# EAGLE design cdf-teensy-interrupter-v3 (EAGLE 9.6.2)
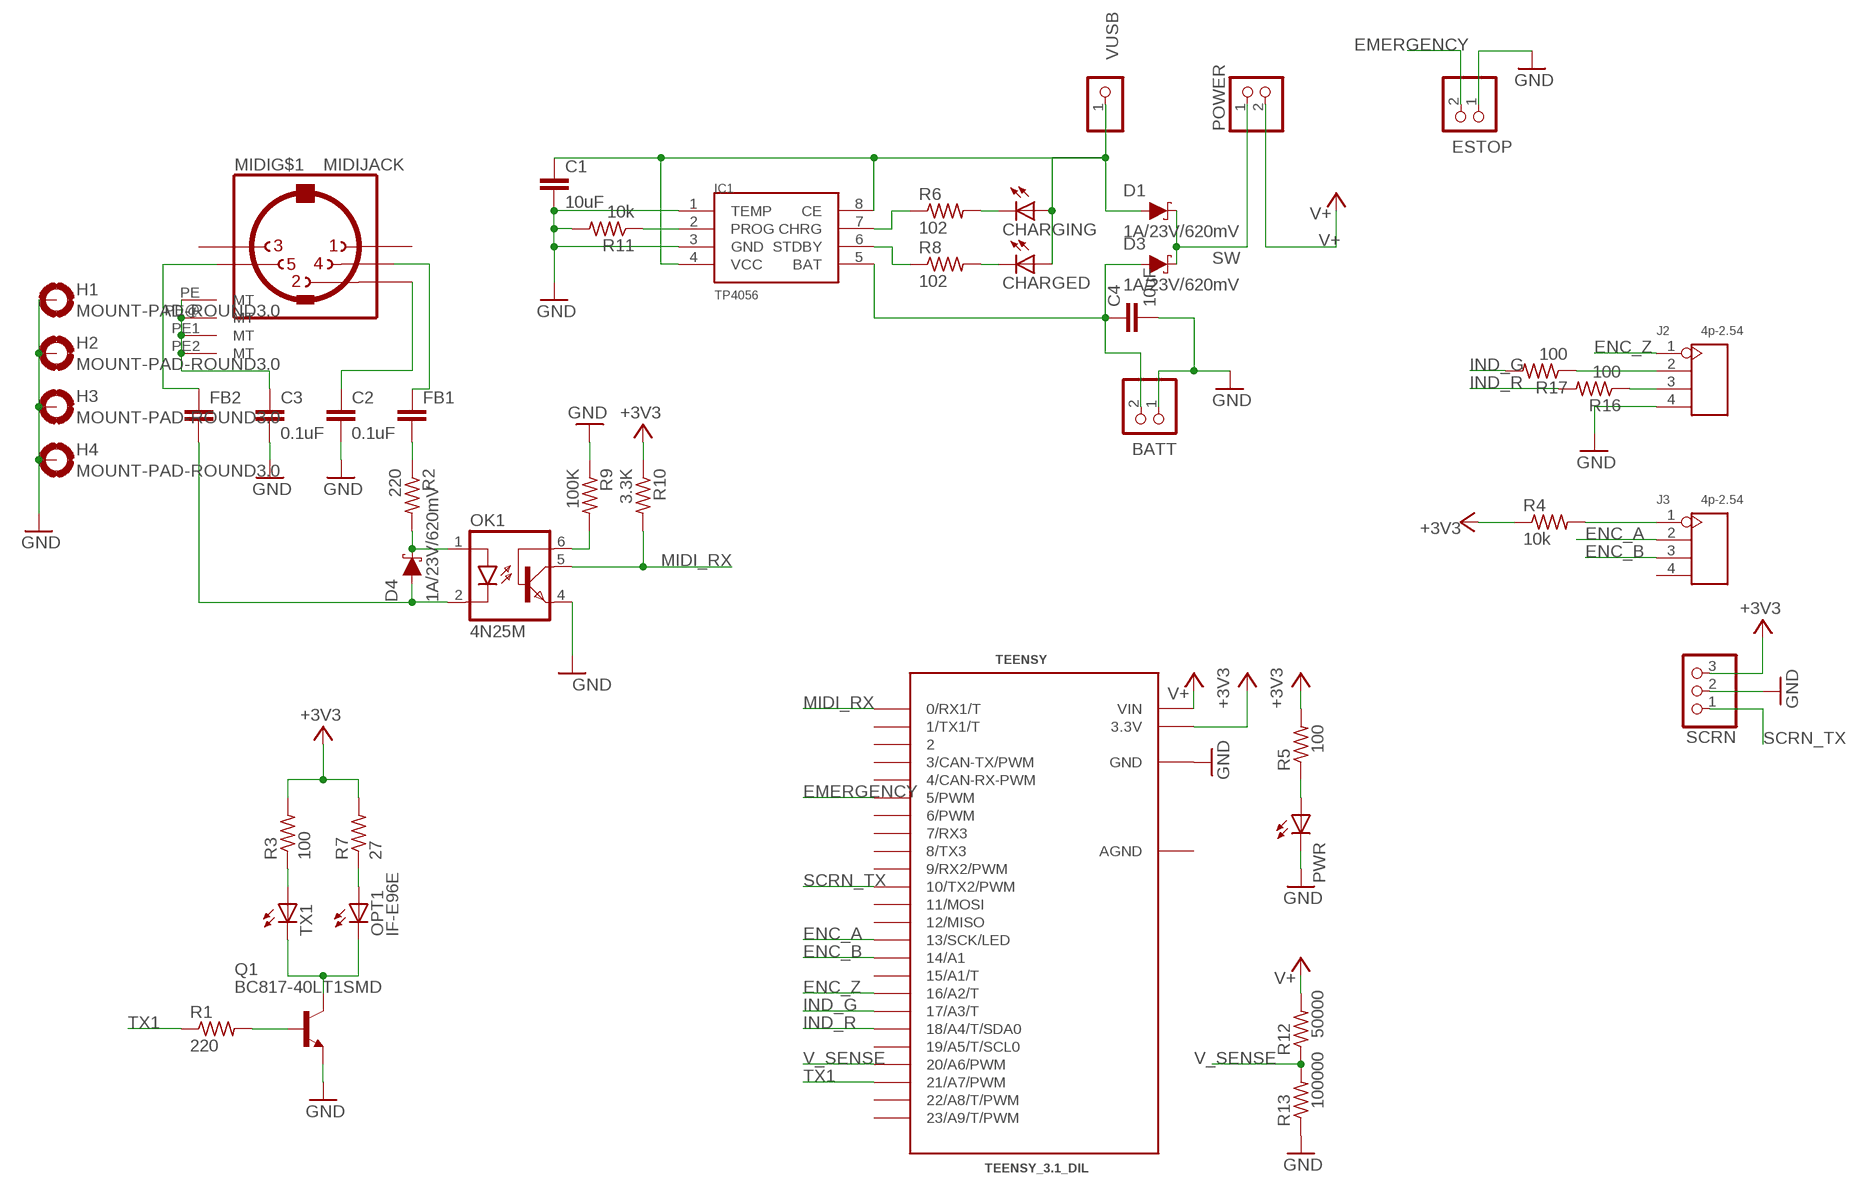
[diagram p0: schematic, sheet 1]

## Parts
BATT  PINHD-1X2  [1X02]
C1  10uF  C-EUC0805  [C0805]
C2  0.1uF  C-EUC0805  [C0805]
C3  0.1uF  C-EUC0805  [C0805]
C4  10uF  C-EUC0805  [C0805]
CHARGED  LEDCHIP-LED0805  [CHIP-LED0805]
CHARGING  LEDCHIP-LED0805  [CHIP-LED0805]
D1  1A/23V/620mV  DIODE-SCHOTTKY-BAT20J  [SOD-323]
D3  1A/23V/620mV  DIODE-SCHOTTKY-BAT20J  [SOD-323]
D4  1A/23V/620mV  DIODE-SCHOTTKY-BAT20J  [SOD-323]
ESTOP  PINHD-1X2  [1X02]
FB1  C-EUC0805  [C0805]
FB2  C-EUC0805  [C0805]
H1  MOUNT-PAD-ROUND3.0  [3,0-PAD]
H2  MOUNT-PAD-ROUND3.0  [3,0-PAD]
H3  MOUNT-PAD-ROUND3.0  [3,0-PAD]
H4  MOUNT-PAD-ROUND3.0  [3,0-PAD]
IC1  TP4056  [SOP-8]
J2  4p-2.54  DIP-BLACK-MALE-HEADER-VERT(4P-2.54)  [H4-2.54]
J3  4p-2.54  DIP-BLACK-MALE-HEADER-VERT(4P-2.54)  [H4-2.54]
MIDI  MIDIJACK  [CP-2350]
OK1  4N25M  [DIL06]
OPT1  IF-E96E  [IF-E96E]
POWER  PINHD-1X2  [1X02]
PWR  LEDCHIP-LED0805  [CHIP-LED0805]
Q1  BC817-40LT1SMD  [SOT23-BEC]
R1  220  R-US_R0805  [R0805]
R2  220  R-US_R0805  [R0805]
R3  100  R-US_R0805  [R0805]
R4  10k  R-US_R0805  [R0805]
R5  100  R-US_R0805  [R0805]
R6  102  R-US_R0805  [R0805]
R7  27  R-US_R0805  [R0805]
R8  102  R-US_R0805  [R0805]
R9  100K  R-US_R0805  [R0805]
R10  3.3K  R-US_R0805  [R0805]
R11  10k  R-US_R0805  [R0805]
R12  50000  R-US_R0805  [R0805]
R13  100000  R-US_R0805  [R0805]
R16  100  R-US_R0805  [R0805]
R17  100  R-US_R0805  [R0805]
SCRN  PINHD-1X3  [1X03]
TEENSY  TEENSY_3.1_DIL  [TEENSY3-DIL]
TX1  LEDCHIP-LED0805  [CHIP-LED0805]
VUSB  PINHD-1X1  [1X01]

## Nets
+3V3: R3.2 R4.1 R5.2 R7.2 R10.1 SCRN.3 TEENSY.3.3V
B+: BATT.2 C4.1 D3.A IC1.5(BAT)
EMERGENCY: ESTOP.2 TEENSY.5(5/PWM)
ENC_A: J3.2 TEENSY.13(13/SCK/LED)
ENC_B: J3.3 TEENSY.14/A0(14/A1)
ENC_Z: J2.1 TEENSY.16/A2(16/A2/T)
GND: BATT.1 C1.2 C2.2 C3.2 C4.2 ESTOP.1 H1.B3,0(MOUNT) H2.B3,0(MOUNT) H3.B3,0(MOUNT) H4.B3,0(MOUNT) IC1.1(TEMP) IC1.3(GND) J2.4 OK1.4(EMI) PWR.C Q1.E R9.1 R11.2 R13.1 SCRN.2 TEENSY.GND
IND_G: R17.2 TEENSY.17/A3(17/A3/T)
IND_R: R16.2 TEENSY.18/A4(18/A4/T/SDA0)
MIDI_RX: OK1.5(COL) R10.2 TEENSY.0(0/RX1/T)
N$1: FB1.1 MIDI.4
N$2: D4.C OK1.1(A) R2.2
N$3: D4.A FB2.2 OK1.2(C)
N$4: OK1.6(BAS) R9.2
N$5: J3.1 R4.2
N$6: J2.2 R17.1
N$7: Q1.B R1.2
N$8: OPT1.P$2_ANODE+(A) R7.1
N$9: PWR.A R5.1
N$10: R3.1 TX1.A
N$11: OPT1.P$1_CATHODE-(C) Q1.C TX1.C
N$12: FB1.2 R2.1
N$13: C2.1 MIDI.2
N$14: C3.1 MIDI.PE1(MT) MIDI.PE2(MT) MIDI.PE(MT) MIDI.PE@(MT)
N$15: FB2.1 MIDI.5
N$16: IC1.7(CHRG) R6.1
N$17: IC1.6(STDBY) R8.1
N$18: CHARGED.C R8.2
N$19: CHARGING.C R6.2
N$20: J2.3 R16.1
N$21: IC1.2(PROG) R11.1
SCRN_TX: SCRN.1 TEENSY.10(10/TX2/PWM)
SW: D1.C D3.C POWER.1
TX1: R1.1 TEENSY.21/A7(21/A7/PWM)
V+: POWER.2 R12.2 TEENSY.VIN
V_SENSE: R12.1 R13.2 TEENSY.20/A6(20/A6/PWM)
V_USB: C1.1 CHARGED.A CHARGING.A D1.A IC1.4(VCC) IC1.8(CE) VUSB.1
Unconnected: J3.4 MIDI.1 MIDI.3 TEENSY.1(1/TX1/T) TEENSY.2 TEENSY.3(3/CAN-TX/PWM) TEENSY.4(4/CAN-RX-PWM) TEENSY.6(6/PWM) TEENSY.7(7/RX3) TEENSY.8(8/TX3) TEENSY.9(9/RX2/PWM) TEENSY.11(11/MOSI) TEENSY.12(12/MISO) TEENSY.15/A1(15/A1/T) TEENSY.19/A5(19/A5/T/SCL0) TEENSY.22/A8(22/A8/T/PWM) TEENSY.23/A9(23/A9/T/PWM)

## Power pins joined to a net without a drawn wire
AGND: TEENSY.AGND

## Library data of the parts
BATT ESTOP POWER = pinhead:PINHD-1X2: PIN HEADER
C1-C4 FB1 FB2 = rcl:C-EU: CAPACITOR, European symbol; SPICEPREFIX: C
CHARGED CHARGING PWR TX1 = adafruit:LED: LED OSRAM: - CHIPLED LG R971, LG N971, LY N971, LG Q971, LY Q971, LO R971, LY R971 LH N974, LH R974 LS Q976, LO Q976, LY Q976 LO Q996 - Hyper CHIPLED LW Q18S LB Q993, LB Q99A, LB R99A - SideLED LS A670, LO A670, LY A670, LG A670, LP A670 LB A673, LV A673, LT A673, LW A673 LH A674 LY A675 LS A676, LA A676, LO A676, LY A676, LW A676 LS A679, LY A679, LG A679 - Hyper Micro SIDELED® LS Y876, LA Y876, LO Y876, LY Y876 LT Y87S - SmartLED LW L88C, LW L88S LB L89C, LB L89S, LG L890 LS L89K, LO L89K, LY L89K LS L896, LA L896, LO L896, LY L896 - TOPLED LS T670, LO T670, LY T670, LG T670, LP T670 LSG T670, LSP T670, LSY T670, LOP T670, LYG T670 LG T671, LOG T671, LSG T671 LB T673, LV T673, LT T673, LW T673 LH T674 LS T676, LA T676, LO T676, LY T676, LB T676, LH T676, LSB T676, LW T676 LB T67C, LV T67C, LT T67C, LS T67K, LO T67K, LY T67K, LW E67C LS E67B, LA E67B, LO E67B, LY E67B, LB E67C, LV E67C, LT E67C LW T67C LS T679, LY T679, LG T679 LS T770, LO T770, LY T770, LG T770, LP T770 LB T773, LV T773, LT T773, LW T773 LH T774 LS E675, LA E675, LY E675, LS T675 LS T776, LA T776, LO T776, LY T776, LB T776 LHGB T686 LT T68C, LB T68C - Hyper Mini TOPLED® LB M676 - Mini TOPLED Santana® LG M470 LS M47K, LO M47K, LY M47K Source: http://www.osram.convergy.de/
D1 D3 D4 = SparkFun-DiscreteSemi:DIODE-SCHOTTKY: Schottky diode A Schottky diode is a semiconductor diode which has a low forward voltage drop and a very fast switching action.; PROD_ID: DIO-11623
H1-H4 = holes:MOUNT-PAD-ROUND: MOUNTING PAD, round
IC1 = TP4056:TP4056
J2 J3 = OPL_Connector:DIP-BLACK-MALE-HEADER-VERT(4P-2.54): 320020017; MPN: P125-1104A0BS116A1
MIDI = adafruit:MIDIJACK: DIN 5 jack also known as MIDI jack A modification of conn-hirshman:MAB5SH with two options for the grounding 'teeth'
OK1 = optocoupler:4N*?M: General Purpose 6-Pin Phototransistor Optocouplers Source: http://www.fairchildsemi.com/ds/4N/4N35-M.pdf; MPN: 4N25-M; OC_FARNELL: 1021349; OC_NEWARK: 98K9084
OPT1 = keves:IF-E96E
Q1 = transistor-npn:BC817*: NPN Transistor
R1-R13 R16 R17 = rcl:R-US_: RESISTOR, American symbol; SPICEPREFIX: R
SCRN = adafruit:PINHD-1X3: PIN HEADER
TEENSY = Teensy_3_and_LC_Series_Boards_v1.1:TEENSY_3.1_DIL: Teensy 3.1 or 3.2 in a DIL Layout.
VUSB = adafruit:PINHD-1X1: Pin header 1x1 for 0.1" spacing With round pins

## Board
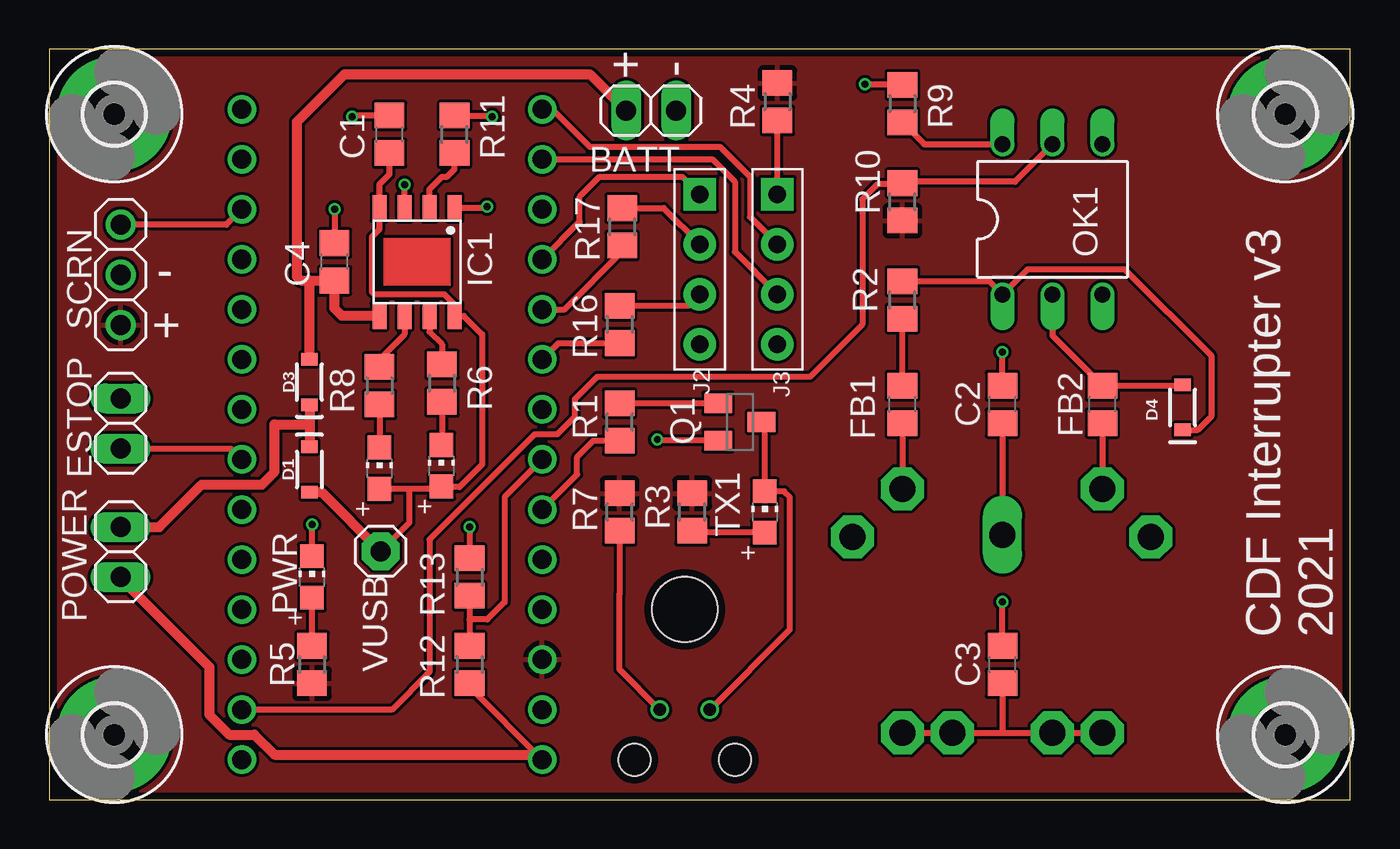
[diagram p1: board, top side]
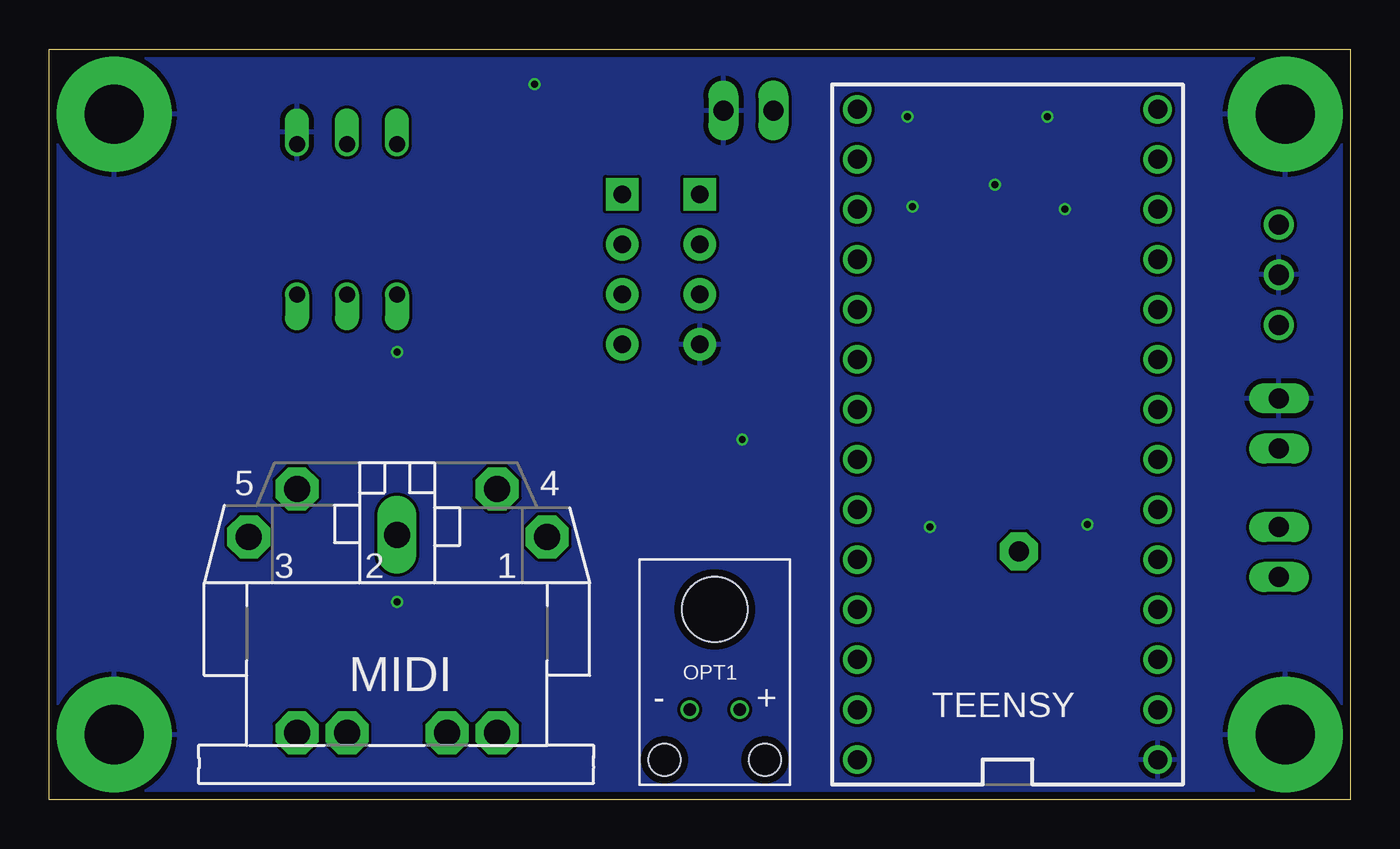
[diagram p2: board, bottom side, seen from below]

Size 66.04 x 38.1 mm. Coordinates in mm from the lower left corner, seen from the top.
Outline: 66.04,38.1 0,38.1 0,0 66.04,0 66.04,38.1
Copper layers (1*16): Top 0.035559375mm / dielectric 1.6mm / Bottom 0.035559375mm
Design rules "oshpark-2layer": minimum track width 6mil, minimum drill 10mil, track to track 6mil, track to pad 6mil, pad to pad 6mil, via to via 6mil, smd to smd 6mil, copper to edge 15mil, drill to drill 6mil, minimum pad ring 5mil, minimum via ring 5mil, stop-mask expansion 2.5mil, vias tented up to drill 0mil, thermal gap 10mil

### Footprints (pad centres in the part's own frame; a part is rotated, then mirrored left to right if it is on the bottom)
1X02 = drill 1.016 long: 1 -1.27,0; 2 1.27,0
C0805 = smd 1.3 x 1.5: 1 -0.95,0; 2 0.95,0
CHIP-LED0805 = smd 1.2 x 1.2: A 0,-1.05; C 0,1.05
SOD-323 = smd 0.63 x 0.83: A 1.15,0; C -1.15,0
3,0-PAD = drill 3 pad 5.842: B3,0 0,0
SOP-8 = smd 1.3 x 0.7: 1 -2.75,1.905; 2 -2.75,0.635; 3 -2.75,-0.635; 4 -2.75,-1.905; 5 2.75,-1.905; 6 2.75,-0.635; 7 2.75,0.635; 8 2.75,1.905
H4-2.54 = drill 0.889 pad 1.651 square: 1 0,3.81 | drill 0.889 pad 1.651: 2 0,1.27; 3 0,-1.27; 4 0,-3.81
CP-2350 = drill 1.321 pad 2.184 octagon: 1 7.62,12.58; 3 -7.52,12.58; 4 5.08,15.02; 5 -5.08,15.02; PE -2.54,2.62; PE1 -5.08,2.62; PE2 5.08,2.62; PE@ 2.54,2.62 | drill 1.321 long: 2 0,12.68
DIL06 = drill 0.813 offset: 1 -2.54,-3.81; 2 0,-3.81; 3 2.54,-3.81; 4 2.54,3.81; 5 0,3.81; 6 -2.54,3.81
IF-E96E = drill 0.635: P$1_CATHODE- 1.27,-2.54; P$2_ANODE+ -1.27,-2.54 | hole 3.302: 0,-7.62 | hole 1.626: 2.54,0; -2.54,0
SOT23-BEC = smd 1 x 1.4: B -0.95,-1.1; C 0,1.1; E 0.95,-1.1
R0805 = smd 1.3 x 1.5: 1 -0.95,0; 2 0.95,0
1X03 = drill 1.016: 1 -2.54,0; 2 0,0; 3 2.54,0
TEENSY3-DIL = drill 0.965: 0 -7.62,13.97; 1 -7.62,11.43; 2 -7.62,8.89; 3 -7.62,6.35; 3.3V 7.62,11.43; 4 -7.62,3.81; 5 -7.62,1.27; 6 -7.62,-1.27; 7 -7.62,-3.81; 8 -7.62,-6.35; 9 -7.62,-8.89; 10 -7.62,-11.43; 11 -7.62,-13.97; 12 -7.62,-16.51; 13 7.62,-16.51; 14/A0 7.62,-13.97; 15/A1 7.62,-11.43; 16/A2 7.62,-8.89; 17/A3 7.62,-6.35; 18/A4 7.62,-3.81; 19/A5 7.62,-1.27; 20/A6 7.62,1.27; 21/A7 7.62,3.81; 22/A8 7.62,6.35; 23/A9 7.62,8.89; AGND 7.62,13.97; GND -7.62,16.51; VIN 7.62,16.51
1X01 = drill 1.016 pad 1.93 octagon: 1 0,0

### Placement (x,y rotation side)
BATT  30.55,34.99 180 top
C1  17.27,33.78 90 top
C2  48.39,20.07 90 top
C3  48.39,6.86 90 top
C4  14.48,27.3 90 top
CHARGED  16.76,16.83 0 top
CHARGING  19.9,16.95 0 top
D1  13.21,16.76 270 top
D3  13.21,21.21 90 top
D4  57.53,19.92 90 top
ESTOP  3.62,19.1 270 top
FB1  43.31,20.07 90 top
FB2  53.47,20.07 90 top
H1  62.74,3.3 0 top
H2  62.74,34.8 0 top
H3  3.3,3.3 0 top
H4  3.3,34.8 0 top
IC1  18.67,27.3 270 top
J2  33.02,26.92 0 top
J3  36.96,26.92 0 top
MIDI  48.39,0.76 0 bottom
OK1  50.93,29.46 0 top
OPT1  32.26,2.03 180 bottom
POWER  3.62,12.57 270 top
PWR  13.34,11.3 0 top
Q1  35.05,19.18 270 top
R1  28.96,19.18 90 top
R2  43.31,25.37 90 top
R3  32.64,14.61 90 top
R4  36.96,35.43 270 top
R5  13.34,6.86 270 top
R6  19.93,21.15 270 top
R7  28.96,14.61 90 top
R8  16.76,21.02 270 top
R9  43.31,35.34 270 top
R10  43.31,30.35 90 top
R11  20.57,33.78 90 top
R12  21.34,6.86 270 top
R13  21.34,11.3 270 top
R16  28.96,24.13 270 top
R17  29.08,29.08 270 top
SCRN  3.62,26.65 270 top
TEENSY  17.4,18.54 180 bottom
TX1  36.32,14.61 0 top
VUSB  16.83,12.6 270 top

### Tracks (layer width: path | path; a pad name or v marks a point on that pad's centre or on a via)
+3V3
  pour Top: 65.79,37.85 0.25,37.85 0.25,0.25 65.79,0.25
B+
  Top 0.508: IC1.5 14.86,24.55 14.48,24.94 C4.1 13.21,26.36 | D3.A 13.21,26.36 | 13.21,26.36 12.76,26.36 12.57,26.54 12.57,34.42 14.99,36.83 27.44,36.83 BATT.2
EMERGENCY
  Top 0.305: ESTOP.2 9.22,17.83 TEENSY.5
ENC_A
  Top 0.305: TEENSY.13 25.53,35.05 27.43,33.15 34.04,33.15 35.56,31.62 35.56,29.59 J3.2
ENC_B
  Top 0.305: TEENSY.14/A0 33.66,32.51 34.8,31.37 34.8,27.81 J3.3
ENC_Z
  Top 0.305: TEENSY.16/A2 26.92,29.34 26.92,30.61 27.94,31.62 32.13,31.62 J2.1
GND  (via drill 0.35)
  Top 0.305: C2.2 v48.39,22.73 | PWR.C v13.34,13.97 | IC1.1 22.18,30.05 v22.23,30.1 | C3.2 v48.39,10.03 | v21.34,13.84 R13.1 | Q1.E 30.92,18.23 v30.86,18.29 | IC1.3 v18.03,31.22 | v14.48,29.97 C4.2 | R11.2 22.42,34.73 v22.48,34.67 | C1.2 15.43,34.73 v15.37,34.67 | R9.1 41.44,36.29 v41.4,36.32
  pour Bottom: 65.91,37.98 0.13,37.97 0.13,0.13 65.91,0.13
IND_G
  Top 0.305: TEENSY.17/A3 26.16,24.89 29.08,27.81 R17.2
IND_R
  Top 0.305: TEENSY.18/A4 25.85,23.18 R16.2
MIDI_RX
  Top 0.305: OK1.5 49.02,31.37 43.37,31.37 R10.2 43.25,31.24 42.04,31.24 41.27,30.48 41.27,24.13 38.61,21.46 27.81,21.46 26.67,20.32 26.67,19.43 25.78,18.54 24.64,18.54 19.3,13.21 19.3,6.48 17.4,4.57 TEENSY.0
N$1
  Top 0.305: FB1.1 MIDI.4
N$2
  Top 0.305: D4.C 58.3,18.77 59.01,19.49 59.01,22.52 54.61,26.92 49.66,26.92 OK1.1 47.72,26.32 R2.2
N$3
  Top 0.305: D4.A 57.48,21.02 FB2.2 50.93,23.56 OK1.2
N$4
  Top 0.305: R9.2 44.42,33.27 OK1.6
N$5
  Top 0.305: J3.1 R4.2
N$6
  Top 0.305: R17.1 31.18,30.03 J2.2
N$7
  Top 0.305: R1.2 Q1.B
N$8
  Top 0.305: OPT1.P$2_ANODE+ 28.93,6.63 28.93,10.43 28.96,10.46 R7.1
N$9
  Top 0.305: R5.1 PWR.A
N$10
  Top 0.305: TX1.A 32.74,13.55 R3.1
N$11
  Top 0.305: OPT1.P$1_CATHODE- 37.59,8.64 37.59,15.37 37.3,15.65 TX1.C 36.32,18.67 36.15,18.84 Q1.C
N$12
  Top 0.305: FB1.2 R2.1
N$13
  Top 0.305: C2.1 MIDI.2
N$14
  Top 0.305: MIDI.PE1 MIDI.PE 48.39,3.38 | 48.39,3.38 MIDI.PE@ MIDI.PE2 | C3.1 48.39,3.38
N$15
  Top 0.305: FB2.1 MIDI.5
N$16
  Top 0.305: IC1.7 19.3,23.75 19.93,23.12 R6.1
N$17
  Top 0.305: IC1.6 18.03,23.62 16.76,22.35 R8.1
N$18
  Top 0.305: R8.2 CHARGED.C | CHARGED.C
N$19
  Top 0.305: R6.2 19.93,18.04 CHARGING.C
N$20
  Top 0.305: R16.1 32.45,25.08 J2.3
N$21
  Top 0.305: IC1.2 19.3,30.99 19.94,31.62 20.19,31.62 20.57,32 R11.1
SCRN_TX
  Top 0.305: TEENSY.10 8.99,29.19 SCRN.1
SW
  Top 0.508: D3.C 13.21,19.05 | 13.21,19.05 D1.C | POWER.1 5.59,13.84 7.75,16 10.79,16 11.43,16.64 11.43,19.05 13.21,19.05
TX1
  Top 0.305: TEENSY.21/A7 26.8,16.51 26.8,17.4 27.62,18.23 R1.1
V+
  Top 0.305: TEENSY.VIN 21.34,5.71 R12.2
  Top 0.508: TEENSY.VIN 24.77,2.29 11.43,2.29 10.41,3.3 9.14,3.3 8.13,4.32 8.13,6.73 3.62,11.24 POWER.2
V_SENSE
  Top 0.305: TEENSY.20/A6 23.11,15.37 23.11,10.03 22.23,9.14 21.34,9.14 | R13.2 21.34,9.14 | 21.34,9.14 R12.1
V_USB
  Top 0.305: 18.29,15.78 19.78,15.78 CHARGING.A 19.93,15.88 20.83,15.88 21.97,17.02 21.97,23.62 21.04,24.55 IC1.8 20.57,25.15 20.07,25.65 16.51,25.65 16.38,25.78 16.38,28.57 16.76,28.96 IC1.4 16.76,31.24 17.27,31.75 C1.1 | 18.29,15.78 CHARGED.A | VUSB.1 18.29,14.06 18.29,15.78
  Top 0.508: D1.A 13.82,15.61 VUSB.1

### Text on the board
tPlace: CDF Interrupter v3 / 2021
tNames: + | - | - | +